# Altium project CEM3340_vco.PrjPcb (part 1 of 2)
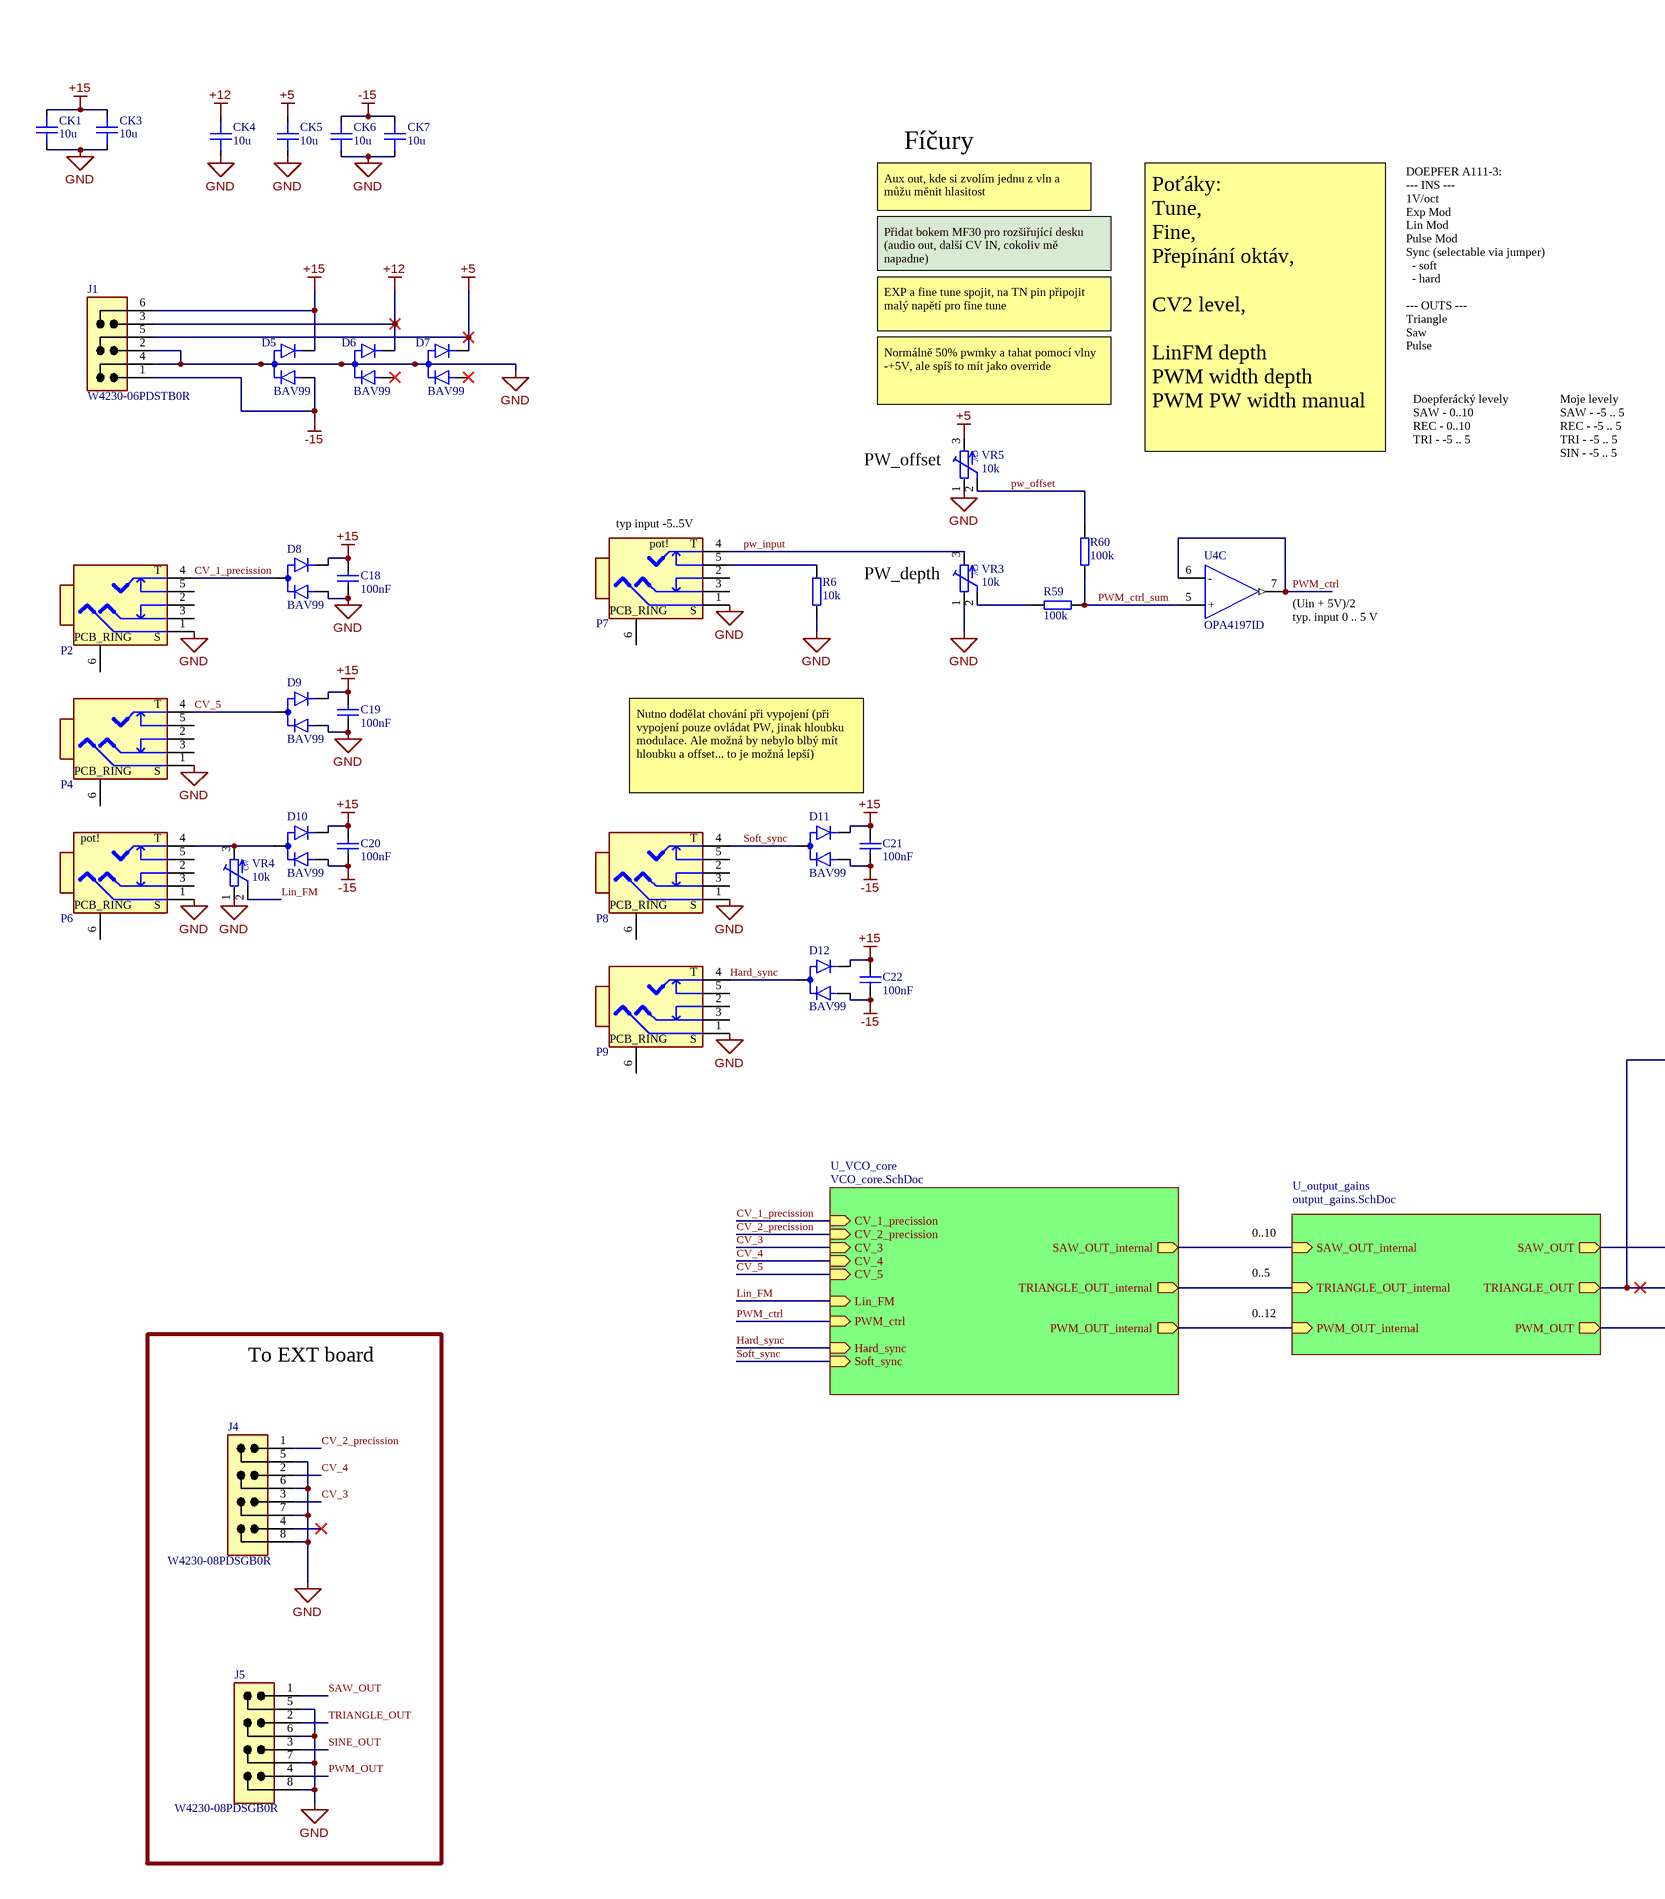
[diagram p0: main.SchDoc, left]
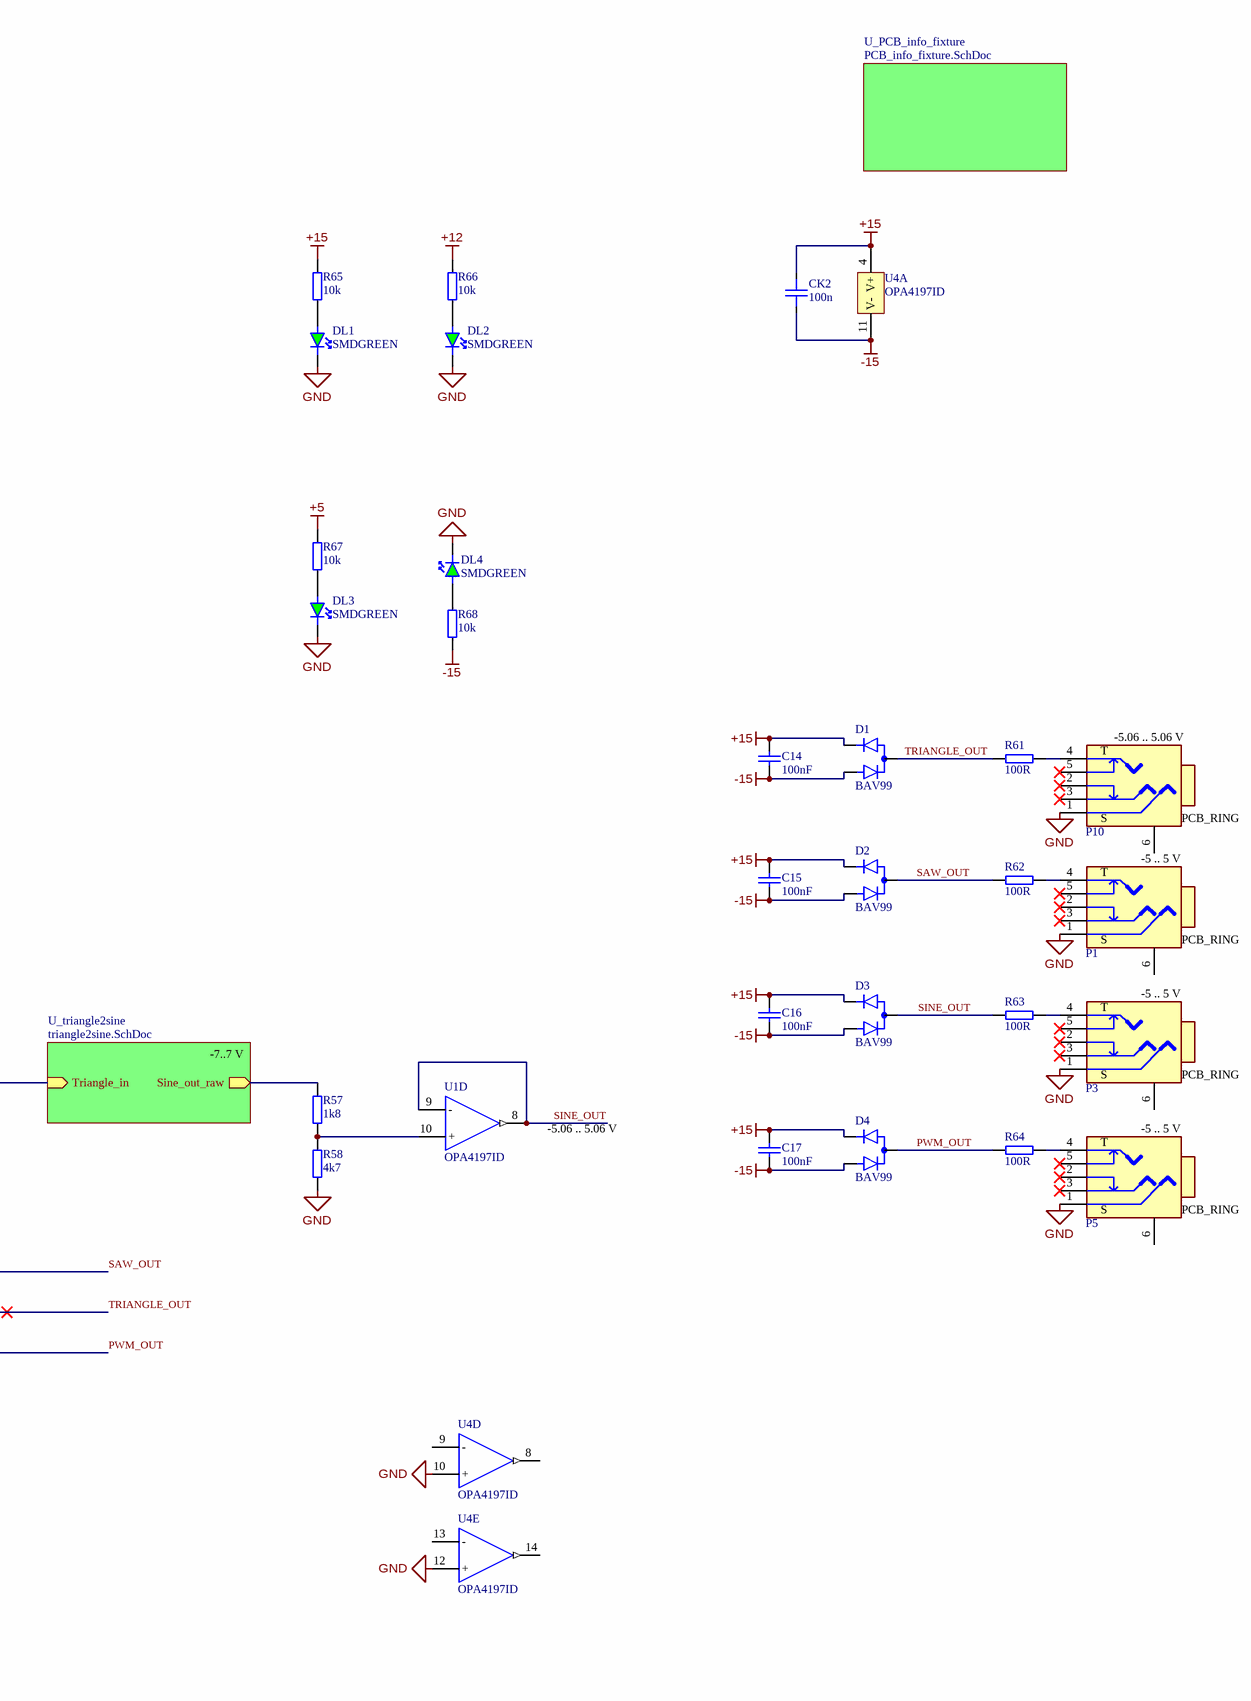
[diagram p1: main.SchDoc, right]
5 sheets, 145 parts. Net scope: hierarchical (ports join the sheet entries above them; power ports are global).
Board file: CEM3340_vco.PcbDoc
Sheets:
  main.SchDoc
    U_VCO_core = VCO_core.SchDoc
    U_output_gains = output_gains.SchDoc
    U_triangle2sine = triangle2sine.SchDoc
    U_PCB_info_fixture = PCB_info_fixture.SchDoc

## Sheet main.SchDoc
size A2; Organization: Medical Technologies CZ a.s.; Version1: N/A; Version2: N/A; Version3: N/A; Change1description: N/A; Change2description: N/A; Change3description: N/A; Change1DrawnBy: N/A; Change2DrawnBy: N/A; Change3DrawnBy: N/A; Change1CheckedBy: N/A; Change2CheckedBy: N/A; Change3CheckedBy: N/A; PreviusVersion_Chng1: N/A; PreviusVersion_Chng2: N/A; PreviusVersion_Chng3: N/A; Variant1description: Standard assembly; Variant2description: N/A; Variant3description: N/A; Variant4description: N/A; PrimaryCard1: XXXxxxXXX; PrimaryCard2: N/A; PrimaryCard3: N/A; PrimaryCard4: N/A; SPICEModelCacheQPKUSXFH: <root> / <DocumentId>QPKUSXFH</DocumentId> / <CacheFrame Number="0"> / <Model Name="vccs_lim_4_opa197" Kind="CKT"> / <Text>* / .subckt VCCS_LIM_4_OPA197 VC+ VC- IOUT+ IOUT- / .param Gain = 1 / .param Ipos = 1.044 / .param Ineg = -1.044 / G1 IOUT+ IOUT- VALUE={LIMIT(Gain*V(VC+,VC-),Ineg,Ipos)} / .ends VCCS_LIM_4_OPA197</Text> / </Model> / <Model Name="vccs_lim_clawp_opa197" Kind="CKT"> / <Text>* / .subckt VCCS_LIM_CLAWp_OPA197 VC+ VC- IOUT+ IOUT- / G1 IOUT+ IOUT- TABLE {(V(VC+,VC-))} = / +(0, 8.15e-6) / +(31.9, 1.41e-3) / +(44.7, 2.13e-3) / +(57.1, 3.04e-3) / +(63.8, 3.76e-3) / +(66.5, 4.23e-3) / +(67.7, 4.54e-3) / +(68.9, 1.77e-2) / .ends VCCS_LIM_CLAWp_OPA197</Text> / </Model> / <Model Name="vos_drift_opa197" Kind="CKT"> / <Text>* / .SUBCKT VOS_DRIFT_OPA197  VOS+ VOS- / .PARAM DC = 1.712E-05 / .PARAM POL = 1 / .PARAM DRIFT = 2.50E-07 / E1 VOS+ VOS- VALUE={DC+POL*DRIFT*(TEMP-27)} / .ENDS</Text> / </Model> / <Model Name="vccs_lim_clawn_opa197" Kind="CKT"> / <Text>* / .subckt VCCS_LIM_CLAWn_OPA197 VC+ VC- IOUT+ IOUT- / G1 IOUT+ IOUT- TABLE {(V(VC+,VC-))} = / +(0, 8.23e-6) / +(15.9, 6.9e-4) / +(63.8, 3.18e-3) / +(67.7, 3.54e-3) / +(68.9, 1.8e-2) / .ends VCCS_LIM_CLAWn_OPA197</Text> / </Model> / <Model Name="vccs_ext_lim_opa197" Kind="CKT"> / <Text>* / .subckt VCCS_EXT_LIM_OPA197 VIN+ VIN- IOUT- IOUT+ VP+ VP- / .param Gain = 1 / G1 IOUT+ IOUT- VALUE={LIMIT(Gain*V(VIN+,VIN-),V(VP-,VIN-), V(VP+,VIN-))} / .ends VCCS_EXT_LIM_OPA197</Text> / </Model> / <Model Name="vccs_lim_iq_opa197" Kind="CKT"> / <Text>* / .subckt VCCS_LIM_IQ_OPA197 VC+ VC- IOUT+ IOUT- / .param Gain = 1e-3 / G1 IOUT+ IOUT- VALUE={IF( (V(VC+,VC-)&lt;=0),0,Gain*V(VC+,VC-) )} / .ends VCCS_LIM_IQ_OPA197</Text> / </Model> / <Model Name="clamp_amp_lo_opa197" Kind="CKT"> / <Text>* / .subckt CLAMP_AMP_LO_OPA197 VC+ VC- VIN COM VO+ VO- / .param G=1 / GVo+ COM Vo+ Value = {IF(V(VIN,COM)&gt;V(VC+,COM),((V(VIN,COM)-V(VC+,COM))*G),0)} / GVo- COM Vo- Value = {IF(V(VIN,COM)&lt;V(VC-,COM),((V(VC-,COM)-V(VIN,COM))*G),0)} / .ends CLAMP_AMP_LO_OPA197</Text> / </Model> / <Model Name="ol_sense_opa197" Kind="CKT"> / <Text>* / .subckt OL_SENSE_OPA197 1   2  3  4 / GSW+ 1 2 Value = {IF((V(3,1)&gt;10e-3 | V(4,1)&gt;10e-3),1,0)} / .ends OL_SENSE_OPA197</Text> / </Model> / <Model Name="vccs_lim_3_opa197" Kind="CKT"> / <Text>* / .subckt VCCS_LIM_3_OPA197 VC+ VC- IOUT+ IOUT- / .param Gain = 1 / .param Ipos = 0.522 / .param Ineg = -0.522 / G1 IOUT+ IOUT- VALUE={LIMIT(Gain*V(VC+,VC-),Ineg,Ipos)} / .ends VCCS_LIM_3_OPA197</Text> / </Model> / <Model Name="vccs_lim_2_opa197" Kind="CKT"> / <Text>* / .subckt VCCS_LIM_2_OPA197 VC+ VC- IOUT+ IOUT- / .param Gain = 74.5e-3 / .param Ipos = 2.4 / .param Ineg = -2.4 / G1 IOUT+ IOUT- VALUE={LIMIT(Gain*V(VC+,VC-),Ineg,Ipos)} / .ends VCCS_LIM_2_OPA197</Text> / </Model> / <Model Name="clamp_amp_hi_opa197" Kind="CKT"> / <Text>* / .subckt CLAMP_AMP_HI_OPA197 VC+ VC- VIN COM VO+ VO- / .param G=10 / GVo+ COM Vo+ Value = {IF(V(VIN,COM)&gt;V(VC+,COM),((V(VIN,COM)-V(VC+,COM))*G),0)} / GVo- COM Vo- Value = {IF(V(VIN,COM)&lt;V(VC-,COM),((V(VC-,COM)-V(VIN,COM))*G),0)} / .ends CLAMP_AMP_HI_OPA197</Text> / </Model> / <Model Name="vccs_lim_gr_opa197" Kind="CKT"> / <Text>* / .subckt VCCS_LIM_GR_OPA197 VC+ VC- IOUT+ IOUT- / .param Gain = 1 / .param Ipos = 4.8 / .param Ineg = -4.8 / G1 IOUT+ IOUT- VALUE={LIMIT(Gain*V(VC+,VC-),Ineg,Ipos)} / .ends VCCS_LIM_GR_OPA197</Text> / </Model> / <Model Name="vnse_opa197" Kind="CKT"> / <Text>* / .subckt VNSE_OPA197 1 2 / .param FLW=0.1 / .param GLF=0.1352 / .param RNV=35.8 / .model DVN D KF={PWR(FLW,0.5)/1E11} IS=1.0E-16 / I1 0 7 10E-3 / I2 0 8 10E-3 / D1 7 0 DVN / D2 8 0 DVN / E1 3 6 7 8 {GLF} / R1 3 0 1E9 / R2 3 0 1E9 / R3 3 6 1E9 / E2 6 4 5 0 10 / R4 5 0 {RNV} / R5 5 0 {RNV} / R6 3 4 1E9 / R7 4 0 1E9 / E3 1 2 3 4 1 / .ends VNSE_OPA197</Text> / </Model> / <Model Name="vccs_lim_zo_opa197" Kind="CKT"> / <Text>* / .subckt VCCS_LIM_ZO_OPA197 VC+ VC- IOUT+ IOUT- / .param Gain = 66667 / .param Ipos = 2.11e4 / .param Ineg = -2.11e4 / G1 IOUT+ IOUT- VALUE={LIMIT(Gain*V(VC+,VC-),Ineg,Ipos)} / .ends VCCS_LIM_ZO_OPA197</Text> / </Model> / <Model Name="femt_opa197" Kind="CKT"> / <Text>* / .subckt FEMT_OPA197 1 2 / .param NVRF=1.5 / .param RNVF={1.184*PWR(NVRF,2)} / E1 3 0 5 0 10 / R1 5 0 {RNVF} / R2 5 0 {RNVF} / G1 1 2 3 0 1e-6 / .ends FEMT_OPA197</Text> / </Model> / <Model Name="vccs_lim_1_opa197" Kind="CKT"> / <Text>* / .subckt VCCS_LIM_1_OPA197 VC+ VC- IOUT+ IOUT- / .param Gain = 1e-4 / .param Ipos = .5 / .param Ineg = -.5 / G1 IOUT+ IOUT- VALUE={LIMIT(Gain*V(VC+,VC-),Ineg,Ipos)} / .ends VCCS_LIM_1_OPA197</Text> / </Model> / <Model Name="opa197" Kind="CKT"> / <Text>*$ / * OPA197 / ***************************************************************************** / * (C) Copyright 2019 Texas Instruments Incorporated. All rights reserved. / ***************************************************************************** / ** This model is designed as an aid for customers of Texas Instruments. / ** TI and its licensors and suppliers make no warranties, either expressed / ** or implied, with respect to this model, including the warranties of / ** merchantability or fitness for a particular purpose.  The model is / ** provided solely on an "as is" basis.  The entire risk as to its quality / ** and performance is with the customer / ***************************************************************************** / * / * This model is subject to change without notice. Texas Instruments / * Incorporated is not responsible for updating this model. / * / ***************************************************************************** / * / ** Released by: Online Design Tools, Texas Instruments Inc. / * Part: OPA197 / * Date: 30JAN2019 / * Model Type: Generic (suitable for all analysis types) / * EVM Order Number: N/A / * EVM Users Guide:  N/A / * Datasheet: SBOS737C â€“JANUARY 2016â€“REVISED MARCH 2018 / * Created with Green-Williams-Lis Op Amp Macro-model Architecture / * / * Model Version: Final 1.1 / * / ***************************************************************************** / * / * Final 1.1 / * Updated with unique subckt name, Vos drift, Current Noise and edits in claw block / * / * Final 1.0 / * Release to Web. / * / ***************************************************************************** / * Model Usage Notes: / * 1. The following parameters are modeled: / * 		OPEN-LOOP GAIN AND PHASE VS. FREQUENCY  WITH RL, CL EFFECTS (Aol) / * 		UNITY GAIN BANDWIDTH (GBW) / * 		INPUT COMMON-MODE REJECTION RATIO VS. FREQUENCY (CMRR) / * 		POWER SUPPLY REJECTION RATIO VS. FREQUENCY (PSRR) / * 		DIFFERENTIAL INPUT IMPEDANCE (Zid) / * 		COMMON-MODE INPUT IMPEDANCE (Zic) / * 		OPEN-LOOP OUTPUT IMPEDANCE VS. FREQUENCY (Zo) / * 		OUTPUT CURRENT THROUGH THE SUPPLY (Iout) / * 		INPUT VOLTAGE NOISE DENSITY VS. FREQUENCY (en) / * 		INPUT CURRENT NOISE DENSITY VS. FREQUENCY (in) / * 		OUTPUT VOLTAGE SWING vs. OUTPUT CURRENT (Vo) / * 		SHORT-CIRCUIT OUTPUT CURRENT (Isc) / * 		QUIESCENT CURRENT (Iq) / * 		SETTLING TIME VS. CAPACITIVE LOAD (ts) / * 		SLEW RATE (SR) / * 		SMALL SIGNAL OVERSHOOT VS. CAPACITIVE LOAD / * 		LARGE SIGNAL RESPONSE / * 		OVERLOAD RECOVERY TIME (tor) / * 		INPUT BIAS CURRENT (Ib) / * 		INPUT OFFSET CURRENT (Ios) / * 		INPUT OFFSET VOLTAGE (Vos) / * 		INPUT OFFSET VOLTAGE VS. TEMPERATURE (VOS DRIFT) / * 		INPUT COMMON-MODE VOLTAGE RANGE (Vcm) / * 		INPUT OFFSET VOLTAGE VS. INPUT COMMON-MODE VOLTAGE (Vos vs. Vcm) / * 		INPUT/OUTPUT ESD CELLS (ESDin, ESDout) / ****************************************************** / .subckt OPA197 IN+ IN- VCC VEE OUT / ****************************************************** / * MODEL DEFINITIONS: / .model ESD_SW VSWITCH(Ron=50 Roff=1e12 Von=700e-3 Voff=100e-3) / .model OL_SW VSWITCH(Ron=1e-3 Roff=1e9 Von=900e-3 Voff=800e-3) / .model OR_SW VSWITCH(Ron=10e-3 Roff=1e9 Von=10e-3 Voff=0) / .model R_NOISELESS RES(T_ABS=-273.15) / ****************************************************** / XV_OS N035 N041 VOS_DRIFT_OPA197 / R1 N038 N036 R_NOISELESS 1e-3 / R2 N047 ESDn R_NOISELESS 1e-3 / R3 N059 0 R_NOISELESS 1e12 / C1 N059 0 1 / R4 VCC_B N058 R_NOISELESS 1e-3 / C2 N058 0 1e-15 / C3 N060 0 1e-15 / R5 N060 VEE_B R_NOISELESS 1e-3 / G1 N038 N039 N007 N006 1e-3 / R6 MID N045 R_NOISELESS 1e12 / VCM_MIN N046 VEE_B -0.1 / R7 N046 MID R_NOISELESS 1e12 / VCM_MAX N045 VCC_B 0.1 / XVCM_CLAMP N039 MID N042 MID N045 N046 VCCS_EXT_LIM_OPA197 / R8 N042 MID R_NOISELESS 1 / C4 N043 MID 1e-15 / R9 N042 N043 R_NOISELESS 1e-3 / V4 N056 OUT 0 / R10 MID N048 R_NOISELESS 1e12 / R11 MID N049 R_NOISELESS 1e12 / XIQp VIMON MID VCC MID VCCS_LIM_IQ_OPA197 / XIQn MID VIMON MID VEE VCCS_LIM_IQ_OPA197 / R12 VCC_B N012 R_NOISELESS 1e3 / R13 N025 VEE_B R_NOISELESS 1e3 / XCLAWp VIMON MID N012 VCC_B VCCS_LIM_CLAWp_OPA197 / XCLAWn MID VIMON VEE_B N025 VCCS_LIM_CLAWn_OPA197 / R14 VEE_CLP MID R_NOISELESS 1e3 / R15 MID VCC_CLP R_NOISELESS 1e3 / R16 N013 N012 R_NOISELESS 1e-3 / R17 N026 N025 R_NOISELESS 1e-3 / C5 MID N013 1e-15 / C6 N026 MID 1e-15 / R18 VOUT_S N049 R_NOISELESS 100 / C7 VOUT_S MID 1e-12 / G2 MID VCC_CLP N013 MID 1e-3 / G3 MID VEE_CLP N026 MID 1e-3 / XCL_AMP N010 N037 VIMON MID N016 N023 CLAMP_AMP_LO_OPA197 / V_ISCp N010 MID 65 / V_ISCn N037 MID -65 / XOL_SENSE_OPA197 MID N063 N062 N065 OL_SENSE_OPA197 / R19 N037 MID R_NOISELESS 1e12 / R20 N023 MID R_NOISELESS 1 / C8 N024 MID 1e-15 / R21 MID N016 R_NOISELESS 1 / R22 MID N010 R_NOISELESS 1e12 / C9 MID N017 1e-15 / XCLAW_AMP VCC_CLP VEE_CLP VOUT_S MID N014 N021 CLAMP_AMP_LO_OPA197 / R23 VEE_CLP MID R_NOISELESS 1e12 / R24 N021 MID R_NOISELESS 1 / C10 N022 MID 1e-15 / R25 MID N014 R_NOISELESS 1 / R26 MID VCC_CLP R_NOISELESS 1e12 / C11 MID N015 1e-15 / XCL_SRC N017 N024 CL_CLAMP MID VCCS_LIM_4_OPA197 / XCLAW_SRC N015 N022 CLAW_CLAMP MID VCCS_LIM_3_OPA197 / R27 N014 N015 R_NOISELESS 1e-3 / R28 N022 N021 R_NOISELESS 1e-3 / R29 N016 N017 R_NOISELESS 1e-3 / R30 N024 N023 R_NOISELESS 1e-3 / R31 N063 MID R_NOISELESS 1 / R32 N063 SW_OL R_NOISELESS 100 / C12 SW_OL MID 1e-12 / R33 VIMON N048 R_NOISELESS 100 / C13 VIMON MID 1e-12 / C_DIFF ESDp ESDn 1.6e-12 / C_CMn ESDn MID 6.4e-12 / C_CMp MID ESDp 6.4e-12 / I_Q VCC VEE 1e-3 / I_B N041 MID 5e-12 / I_OS ESDn MID 3e-12 / R34 IN+ ESDp R_NOISELESS 100 / R35 IN- ESDn R_NOISELESS 100 / R36 N033 MID R_NOISELESS 1 / R37 N040 MID R_NOISELESS 1e12 / R38 MID N019 R_NOISELESS 1 / R39 MID N011 R_NOISELESS 1e12 / XGR_AMP N011 N040 N018 MID N019 N033 CLAMP_AMP_HI_OPA197 / XGR_SRC N020 N034 CLAMP MID VCCS_LIM_GR_OPA197 / C17 MID N020 1e-15 / C18 N034 MID 1e-15 / V_GRn N040 MID -251 / V_GRp N011 MID 251 / R40 N019 N020 R_NOISELESS 1e-3 / R41 N034 N033 R_NOISELESS 1e-3 / R42 VSENSE N018 R_NOISELESS 1e-3 / C19 MID N018 1e-15 / R43 MID VSENSE R_NOISELESS 1e3 / G5 N035 N036 N009 MID 1e-3 / G8 MID CLAW_CLAMP N050 MID 1e-3 / R45 MID CLAW_CLAMP R_NOISELESS 1e3 / G9 MID CL_CLAMP CLAW_CLAMP MID 1e-3 / R46 MID CL_CLAMP R_NOISELESS 1e3 / R47 N057 VCLP R_NOISELESS 100 / C24 MID VCLP 1e-12 / E4 N057 MID CL_CLAMP MID 1 / E5 N049 MID OUT MID 1 / H1 N048 MID V4 1e3 / S1 N052 N051 SW_OL MID OL_SW / R52 MID ESDp R_NOISELESS 1e12 / R53 ESDn MID R_NOISELESS 1e12 / R58 N036 N035 R_NOISELESS 1e3 / R59 N058 N059 R_NOISELESS 1e6 / R60 N059 N060 R_NOISELESS 1e6 / R67 N039 N038 R_NOISELESS 1e3 / G15 MID VSENSE CLAMP MID 1e-3 / V_ORp N032 VCLP 4 / V_ORn N027 VCLP -4 / V11 N029 N028 0 / V12 N030 N031 0 / H2 N061 MID V11 -1 / H3 N064 MID V12 1 / S2 VCC ESDn ESDn VCC ESD_SW / S3 VCC ESDp ESDp VCC ESD_SW / S4 ESDn VEE VEE ESDn ESD_SW / S5 ESDp VEE VEE ESDp ESD_SW / S6 VCC OUT OUT VCC ESD_SW / S7 OUT VEE VEE OUT ESD_SW / E1 MID 0 N059 0 1 / G16 0 VCC_B VCC 0 1 / G17 0 VEE_B VEE 0 1 / R88 VCC_B 0 R_NOISELESS 1 / R89 VEE_B 0 R_NOISELESS 1 / S8 N030 CLAMP CLAMP N030 OR_SW / S9 CLAMP N029 N029 CLAMP OR_SW / Xe_n ESDp N041 VNSE_OPA197 / Xi_nn ESDn MID FEMT_OPA197 / Xi_np N041 MID FEMT_OPA197 / XVCCS_LIMIT_1 N043 N047 MID N044 VCCS_LIM_1_OPA197 / XVCCS_LIMIT_2 N044 MID MID CLAMP VCCS_LIM_2_OPA197 / R44 N044 MID R_NOISELESS 1e6 / R68 CLAMP MID R_NOISELESS 1e6 / G7 MID N050 VSENSE MID 1e-6 / R69 N050 MID R_NOISELESS 1e6 / R72 N062 N061 R_NOISELESS 100 / R75 N064 N065 R_NOISELESS 100 / C27 N062 MID 1e-9 / C28 N065 MID 1e-9 / XVCCS_LIM_ZO_OPA197 N054 MID MID N055 VCCS_LIM_ZO_OPA197 / C15 N007 N008 4.97e-10 / R54 N007 MID R_NOISELESS 320 / R55 N007 N008 R_NOISELESS 1e8 / G13 MID N008 VCC_B MID 68.4e-3 / Rsrc4 N008 MID R_NOISELESS 1 / C16 N006 N005 4.97e-10 / R56 N006 MID R_NOISELESS 320 / R57 N006 N005 R_NOISELESS 1e8 / G14 MID N005 VEE_B MID 68.4e-3 / Rsrc2 N005 MID R_NOISELESS 1 / Rx N056 N055 R_NOISELESS 3.25e5 / Rdummy N056 MID R_NOISELESS 3.25e4 / G4 MID N051 CL_CLAMP N056 90.91 / Rdc1 N051 MID R_NOISELESS 1 / R51 N051 N052 R_NOISELESS 1e4 / R64 N052 MID R_NOISELESS 1184.21 / G6 MID N053 N052 MID 9.44 / C23 N052 N051 1.77e-5 / R65 N053 N054 R_NOISELESS 1e4 / R66 N054 MID R_NOISELESS 0.15 / C26 N054 N053 1.06e-11 / R70 N055 MID R_NOISELESS 1 / R71 N053 MID R_NOISELESS 1 / C21 CLAMP MID 1.13e-7 / C29 N050 MID 7e-15 / C20 N002 N001 7.234e-10 / R50 N002 MID R_NOISELESS 2.2 / R61 N002 N001 R_NOISELESS 1e4 / G_adjust1 MID N001 ESDp MID 454e-6 / Rsrc3 N001 MID R_NOISELESS 1 / G18 MID N003 MID N002 1 / Rsrc5 N003 MID R_NOISELESS 1 / C22 N004 N003 7.234e-10 / R62 N004 N003 R_NOISELESS 1e4 / R63 N004 MID R_NOISELESS 2.2 / G19 MID N009 MID N004 4545.45 / Rsrc6 N009 MID R_NOISELESS 1 / G10 MID N028 N027 MID 1 / G11 MID N031 N032 MID 1 / R48 N028 MID R_NOISELESS 1 / R49 N031 MID R_NOISELESS 1 / .ends OPA197</Text> / <Dependency>0\vccs_lim_4_opa197</Dependency> / <Dependency>0\vccs_lim_clawp_opa197</Dependency> / <Dependency>0\vos_drift_opa197</Dependency> / <Dependency>0\vccs_lim_clawn_opa197</Dependency> / <Dependency>0\vccs_ext_lim_opa197</Dependency> / <Dependency>0\vccs_lim_iq_opa197</Dependency> / <Dependency>0\clamp_amp_lo_opa197</Dependency> / <Dependency>0\ol_sense_opa197</Dependency> / <Dependency>0\vccs_lim_3_opa197</Dependency> / <Dependency>0\vccs_lim_2_opa197</Dependency> / <Dependency>0\clamp_amp_hi_opa197</Dependency> / <Dependency>0\vccs_lim_gr_opa197</Dependency> / <Dependency>0\vnse_opa197</Dependency> / <Dependency>0\vccs_lim_zo_opa197</Dependency> / <Dependency>0\femt_opa197</Dependency> / <Dependency>0\vccs_lim_1_opa197</Dependency> / </Model> / <Model Name="opa197full" Kind="CKT"> / <Text>.SUBCKT OPA197FULL    O1 I1M I1P VCC I2P I2M O2 O3 I3M I3P GND I4P I4M O4 / X1 I1P I1M VCC GND O1 OPA197 / X2 I2P I2M VCC GND O2 OPA197 / X3 I3P I3M VCC GND O3 OPA197 / X4 I4P I4M VCC GND O4 OPA197 / .ENDS OPA197FULL</Text> / <Dependency>0\opa197</Dependency> / </Model> / </CacheFrame> / </root>; DocumentName: Docname

### Parts
C14  100nF  [WCAP-CSGP_0603_L1.6W0.8H0.8_Reflow]
C15  100nF  [WCAP-CSGP_0603_L1.6W0.8H0.8_Reflow]
C16  100nF  [WCAP-CSGP_0603_L1.6W0.8H0.8_Reflow]
C17  100nF  [WCAP-CSGP_0603_L1.6W0.8H0.8_Reflow]
C18  100nF  [WCAP-CSGP_0603_L1.6W0.8H0.8_Reflow]
C19  100nF  [WCAP-CSGP_0603_L1.6W0.8H0.8_Reflow]
C20  100nF  [WCAP-CSGP_0603_L1.6W0.8H0.8_Reflow]
C21  100nF  [WCAP-CSGP_0603_L1.6W0.8H0.8_Reflow]
C22  100nF  [WCAP-CSGP_0603_L1.6W0.8H0.8_Reflow]
CK1  10u  [CAPC3225X27N(SMC1210)]
CK2  100n  [CAPC1608X09N(SMC0603)]
CK3  10u  [CAPC3225X27N(SMC1210)]
CK4  10u  [CAPC3225X27N(SMC1210)]
CK5  10u  [CAPC3225X27N(SMC1210)]
CK6  10u  [CAPC3225X27N(SMC1210)]
CK7  10u  [CAPC3225X27N(SMC1210)]
D1  BAV99  [SOT95P230X110-3N(SOT23)]
D2  BAV99  [SOT95P230X110-3N(SOT23)]
D3  BAV99  [SOT95P230X110-3N(SOT23)]
D4  BAV99  [SOT95P230X110-3N(SOT23)]
D5  BAV99  [SOT95P230X110-3N(SOT23)]
D6  BAV99  [SOT95P230X110-3N(SOT23)]
D7  BAV99  [SOT95P230X110-3N(SOT23)]
D8  BAV99  [SOT95P230X110-3N(SOT23)]
D9  BAV99  [SOT95P230X110-3N(SOT23)]
D10  BAV99  [SOT95P230X110-3N(SOT23)]
D11  BAV99  [SOT95P230X110-3N(SOT23)]
D12  BAV99  [SOT95P230X110-3N(SOT23)]
DL1  SMDGREEN  [DIOC2012X12N(SMLED0805)G]
DL2  SMDGREEN  [DIOC2012X12N(SMLED0805)G]
DL3  SMDGREEN  [DIOC2012X12N(SMLED0805)G]
DL4  SMDGREEN  [DIOC2012X12N(SMLED0805)G]
J1  W4230-06PDSTB0R  [W4230-06PDS]
J4  W4230-08PDSGB0R  [W4230-08PDS]
J5  W4230-08PDSGB0R  [W4230-08PDS]
P1  NYS232  [NYS232]  (value not drawn)
P2  NYS232  [NYS232]  (value not drawn)
P3  NYS232  [NYS232]  (value not drawn)
P4  NYS232  [NYS232]  (value not drawn)
P5  NYS232  [NYS232]  (value not drawn)
P6  NYS232  [NYS232]  (value not drawn)
P7  NYS232  [NYS232]  (value not drawn)
P8  NYS232  [NYS232]  (value not drawn)
P9  NYS232  [NYS232]  (value not drawn)
P10  NYS232  [NYS232]  (value not drawn)
R6  10k  [RESC1608X06N(SMR0603)]
R57  1k8  [RESC1608X06N(SMR0603)]
R58  4k7  [RESC1608X06N(SMR0603)]
R59  100k  [RESC1608X06N(SMR0603)]
R60  100k  [RESC1608X06N(SMR0603)]
R61  100R  [RESC1608X06N(SMR0603)]
R62  100R  [RESC1608X06N(SMR0603)]
R63  100R  [RESC1608X06N(SMR0603)]
R64  100R  [RESC1608X06N(SMR0603)]
R65  10k  [RESC1608X06N(SMR0603)]
R66  10k  [RESC1608X06N(SMR0603)]
R67  10k  [RESC1608X06N(SMR0603)]
R68  10k  [RESC1608X06N(SMR0603)]
U1  OPA4197ID  [SOIC127P600X175-14N(SO-14)]  (part D of 5)
U4  OPA4197ID  [SOIC127P600X175-14N(SO-14)]  (parts A,C,D,E of 5)
VR3  10k  [64W]
VR4  10k  [64W]
VR5  10k  [64W]

### Blocks framed on the sheet
To EXT board: J4 J5

### Sub-sheets
U_output_gains = output_gains.SchDoc: PWM_OUT_internal (in), SAW_OUT_internal (in), SAW_OUT (out), TRIANGLE_OUT_internal (in), PWM_OUT (out), TRIANGLE_OUT (out)
U_PCB_info_fixture = PCB_info_fixture.SchDoc: no entries
U_triangle2sine = triangle2sine.SchDoc: Triangle_in (in), Sine_out_raw (out)
U_VCO_core = VCO_core.SchDoc: Hard_sync (in), CV_2_precission (in), CV_1_precission (in), PWM_ctrl (in), TRIANGLE_OUT_internal (out), CV_5 (in), CV_4 (in), CV_3 (in), SAW_OUT_internal (out), Lin_FM (in), PWM_OUT_internal (out), Soft_sync (in)

### Nets
+5: CK5.1 D7.2(C2) J1.5 R67.2 VR5.3
+12: CK4.1 D6.2(C2) J1.3 R66.2
+15: C14.2 C15.2 C16.2 C17.2 C18.2 C19.2 C20.2 C21.2 C22.2 CK1.1 CK2.1 CK3.1 D1.2(C2) D2.2(C2) D3.2(C2) D4.2(C2) D5.2(C2) D8.2(C2) D9.2(C2) D10.2(C2) D11.2(C2) D12.2(C2) J1.6 R65.2 U4.4(V+)
-15: C14.1 C15.1 C16.1 C17.1 C20.1 C21.1 C22.1 CK2.2 CK6.1 CK7.1 D1.1(A1) D2.1(A1) D3.1(A1) D4.1(A1) D5.1(A1) D10.1(A1) D11.1(A1) D12.1(A1) J1.1 R68.1 U4.11(V-)
GND: C18.1 C19.1 CK1.2 CK3.2 CK4.2 CK5.2 CK6.2 CK7.2 D5.3(C1A2) D6.3(C1A2) D7.3(C1A2) D8.1(A1) D9.1(A1) DL1.1(C) DL2.1(C) DL3.1(C) DL4.1(C) J1.2 J1.4 J4.5 J4.6 J4.7 J4.8 J5.5 J5.6 J5.7 J5.8 P1.1(S) P2.1(S) P3.1(S) P4.1(S) P5.1(S) P6.1(S) P7.1(S) P8.1(S) P9.1(S) P10.1(S) R6.1 R58.1 U4.10(+) U4.12(+) VR3.1 VR4.1 VR5.1
CV_1_precission: D8.3(C1A2) P2.4(TN) ; sheet U_VCO_core/CV_1_precission
CV_2_precission: J4.1 ; sheet U_VCO_core/CV_2_precission
CV_3: J4.3 ; sheet U_VCO_core/CV_3
CV_4: J4.2 ; sheet U_VCO_core/CV_4
CV_5: D9.3(C1A2) P4.4(TN) ; sheet U_VCO_core/CV_5
Hard_sync: D12.3(C1A2) P9.4(TN) ; sheet U_VCO_core/Hard_sync
Lin_FM: VR4.2 ; sheet U_VCO_core/Lin_FM
pw_input: P7.4(TN) VR3.3
pw_offset: R60.2 VR5.2
PWM_ctrl: U4.6(-) U4.7(OUT2) ; sheet U_VCO_core/PWM_ctrl
PWM_ctrl_sum: R59.1 R60.1 U4.5(+)
PWM_OUT: D4.3(C1A2) J5.4 R64.1 ; sheet U_output_gains/PWM_OUT
SAW_OUT: D2.3(C1A2) J5.1 R62.1 ; sheet U_output_gains/SAW_OUT
SINE_OUT: D3.3(C1A2) J5.3 R63.1 U1.8(OUT3) U1.9(-)
Soft_sync: D11.3(C1A2) P8.4(TN) ; sheet U_VCO_core/Soft_sync
TRIANGLE_OUT: D1.3(C1A2) J5.2 R61.1 ; sheet U_output_gains/TRIANGLE_OUT, sheet U_triangle2sine/Triangle_in
NetC10_2: R57.2 ; sheet U_triangle2sine/Sine_out_raw
NetD10_3: D10.3(C1A2) P6.4(TN) VR4.3
NetDL1_2: DL1.2(A) R65.1
NetDL2_2: DL2.2(A) R66.1
NetDL3_2: DL3.2(A) R67.1
NetDL4_2: DL4.2(A) R68.2
NetP1_4: P1.4(TN) R62.2
NetP3_4: P3.4(TN) R63.2
NetP5_4: P5.4(TN) R64.2
NetP7_5: P7.5(T) R6.2
NetP10_4: P10.4(TN) R61.2
NetR15_2: sheet U_VCO_core/PWM_OUT_internal, sheet U_output_gains/PWM_OUT_internal
NetR42_2: sheet U_VCO_core/SAW_OUT_internal, sheet U_output_gains/SAW_OUT_internal
NetR57_1: R57.1 R58.2 U1.10(+)
NetR59_2: R59.2 VR3.2
NetU3_10: sheet U_VCO_core/TRIANGLE_OUT_internal, sheet U_output_gains/TRIANGLE_OUT_internal

Not connected (* = marked no-connect by the designer): D6 1(A1)*; D7 1(A1)*; J4 4*; P1 2(RN)* 3(R)* 5(T)* 6(PCB_RING); P2 2(RN) 3(R) 5(T) 6(PCB_RING); P3 2(RN)* 3(R)* 5(T)* 6(PCB_RING); P4 2(RN) 3(R) 5(T) 6(PCB_RING); P5 2(RN)* 3(R)* 5(T)* 6(PCB_RING); P6 2(RN) 3(R) 5(T) 6(PCB_RING); P7 2(RN) 3(R) 6(PCB_RING); P8 2(RN) 3(R) 5(T) 6(PCB_RING); P9 2(RN) 3(R) 5(T) 6(PCB_RING); P10 2(RN)* 3(R)* 5(T)* 6(PCB_RING); U4 8(OUT3) 9(-) 13(-) 14(OUT4)

### Notes on the sheet
- Fíčury
- Aux out, kde si zvolím jednu z vln a můžu měnit hlasitost
- Přidat bokem MF30 pro rozšiřující desku (audio out, další CV IN, cokoliv mě napadne)
- EXP a fine tune spojit, na TN pin připojit malý napětí pro fine tune
- DOEPFER A111-3:
  --- INS ---
  1V/oct
  Exp Mod
  Lin Mod
  Pulse Mod
  Sync (selectable via jumper)
  - soft
  - hard
  --- OUTS ---
  Triangle
  Saw
  Pulse
- (near VR5) Normálně 50% pwmky a tahat pomocí vlny -+5V, ale spíš to mít jako override
- Poťáky:
  Tune,
  Fine,
  Přepínání oktáv,
  CV2 level,
  LinFM depth
  PWM width depth
  PWM PW width manual
- Doepferácký levely
  SAW - 0..10
  REC - 0..10
  TRI - -5 .. 5
- Moje levely
  SAW - -5 .. 5
  REC - -5 .. 5
  TRI - -5 .. 5
  SIN - -5 .. 5
- (near VR5) PW_offset
- (near P7) typ input -5..5V
- (near P7) pot!
- (near VR3) PW_depth
- (near U4) typ. input 0 .. 5 V
- (near U4) (Uin + 5V)/2
- (near P10) -5.06 .. 5.06 V
- Nutno dodělat chování při vypojení (při vypojení pouze ovládat PW, jinak hloubku modulace. Ale možná by nebylo blbý mít hloubku a offset... to je možná lepší)
- (near P6) pot!
- (near P1) -5 .. 5 V
- (near P3) -5 .. 5 V
- -7..7 V
- (near U1) -5.06 .. 5.06 V
- (near P5) -5 .. 5 V
- 0..10
- 0..5
- 0..12
- Číslo výkresu /drawing number/:
- Nazev listu/sheet name/:
- DPS projekt/PCB project/:
- Kreslil /drawn by/ :
- Kontroloval /checked by/:
- Schvalil /approved by/:
- Podpis /signature/:
- Datum /date/:
- List /sheet/:
- /
- (in symbol NYS232) PCB_RING
- (in symbol Trimmer universal 3/8 (10mm)) CW

### Library data of the parts
C14-C22 = 885012206095: WCAP-CSGP Multilayer Ceramic Chip Capacitor, General Purpose, size 0603, X7R, 100nF, 50V; Manufacturer: Wurth Elektronik; Capacitance Tolerance: +/-10%; Dissipation Factor: 3%; Isolation Resistance: 5GOhm; Technical Reference: X7R0603104K050DFCT10000; Capacitance: 100nF; Ceramic Type: X7R; ComponentLink1Description: Manufacturer Link; ComponentLink1URL: http://www.we-online.de; ComponentLink2Description: Datasheet; ComponentLink2URL: https://www.we-online.com/catalog/datasheet/885012206095.pdf; Height: 0.8mm; Length: 1.6mm; Manufacturer Part Number: 885012206095; Mounting Technology: SMT; Operating Temperature max.: 125C; Operating Temperature min.: -55C; Packaging: Tape and Reel; Rated Voltage: 50V; Size: 0603; Width: 0.8mm
CK1 CK3-CK7 = ECK+10U50VXX0: C; 10u; 50V; 10%; X7R; ??;; Manufacturer: Murata: GRM32ER71H106KA12L;;Samsung Electro-mechanics: CL32B106KBJNNNE; Note: X7R, 9uF @ 10V, 5uF @ 30V, 2.5uF @ 50V; Component_Class: Capacitor; Status_I: Production; Status_II: Active; Tolerance_Pct: 10; Voltage_Rating_V: 50; Capacitance_F: 1E-5; KK: ECK+10U50VXX0; Value: 10u; SMD: 1; ComponentLink2URL: I:\DataSheets\ECK+10U50VXX0_MurataEN100.pdf; ComponentLink2Description: ECK+10U50VXX0_MurataEN100.pdf; ComponentLink3URL: I:\DataSheets\ECK+10U50VXX0_SamsungEN100.pdf; ComponentLink3Description: ECK+10U50VXX0_SamsungEN100.pdf; Dielectric_Type: X7R; ComponentLink1URL: heliosgreen://v1/hegMT/5-MT/Classes(343)/Folders/OpenForm?RecordNumbers=[10658879]; ComponentLink1Description: Helios
CK2 = ECK+100N50V0603XXK: C; 100n; 50V; 10%; X7R; ??;; KK: ECK+100N50V0603XXK
DL1-DL4 = EDL+SMDGREENXX1: Ind; Light; Green;; Manufacturer: KINGBRIGHT: KP-2012MGC; Note: 568nm dominant; Component_Class: Indicator; Status_I: Production; Status_II: Active; KK: EDL+SMDGREENXX1; Value: SMDGREEN; SMD: 1; ComponentLink2URL: i:\datasheets\EDL+SMDGREENXX1_KingBright.pdf; ComponentLink2Description: EDL+SMDGREENXX1_KingBright.pdf; Indicator_Type: Light; Indicator_Output: Green; ComponentLink1URL: heliosgreen://v1/hegMT/5-MT/Classes(343)/Folders/OpenForm?RecordNumbers=[380589]; ComponentLink1Description: Helios
J1 = EJ-W4230-06PDSTB0RXX0: Con; Micro Fit 3.0; 6x; PCB; Straight; 250V; 5A; Male; Tin; ??;; Manufacturer: HSUAN MAO: W4230-06PDSTB0R;;HSUAN MAO: W4230-06PDSTB0N;;HSM: W4230-06PDSTB0R;;HSM: W4230-06PDSTB0N; Component_Class: Connector; Status_I: Production; Status_II: Active; Multiplicity: 6; Voltage_Rating_V: 250; Current_Rating_A: 5; KK: EJ-W4230-06PDSTB0RXX0; Value: W4230-06PDSTB0R; SMD: 0; ComponentLink2URL: i:\datasheets\EJ-W4230-XXPDSXB0RXX0_HsuanMao.pdf; ComponentLink2Description: EJ-W4230-XXPDSXB0RXX0_HsuanMao.pdf; ComponentLink3URL: I:\datasheets\EJ-W4230-XXPDSTB0NXX0_HsuanMaoEN100.pdf; ComponentLink3Description: EJ-W4230-XXPDSTB0NXX0_HsuanMaoEN100.pdf; Mounting_Style: PCB; Connector_Family: Micro Fit 3.0; Angle: Straight; Gender: Male; Plating: Tin; ComponentLink1URL: heliosgreen://v1/hegMT/5-MT/Classes(343)/Folders/OpenForm?RecordNumbers=[6765380]; ComponentLink1Description: Helios; System: Connector
J4 J5 = EJ-W4230-08PDSGB0RXX0: Con; Micro Fit 3.0; 8x; PCB; Straight; 250V; 5A; Male; Gold; ??;; KK: EJ-W4230-08PDSGB0RXX0
P1-P10 = NYS232: 6.3 mm jack, right angle, THT
R6 R57-R68 = R 0603 universal: Thick Film resistor, 0603 Size, universal value, 0.1 W; Tolerance & Rating: 1%/0.1W; Signal Integrity: Res; consumption: 0; RPP: 0,0188; Package: 0603; Simulation: Res; SMD: 1; ComponentLink1Description: ER+xxxx0.1W0603XXx_YageoEN100.pdf; ComponentLink1URL: i:\DataSheets\ER+xxxx0.1W0603XXx_YageoEN100.pdf; ComponentLink3Description: rezistor čip; ComponentLink3URL: heliosgreen://v1/hegMT/5-MT/Classes(343)/Folders/OpenForm?RecordNumbers=[6094847]
  R6 R65-R68: Value: 10k
  R57: Value: 1k8
  R58: Value: 4k7
  R59 R60: Value: 100k
  R61-R64: Value: 100R
U1 U4 = EU+OPA4197IDRXX0: IC; Opamp; 4.5V; 36V; 4x;; KK: EU+OPA4197IDRXX0
VR3-VR5 = Trimmer universal 3/8 (10mm): 093 - 3/8" Square (10 mm) Multi-Turn Cermet Trimmer; KK: ERP-10K0.5WXX0; Value: 10k; SMD: 0; ComponentLink1Description: Datasheet
D1-D12 = BAV99: ComponentLink1Description: New link; ComponentLink1URL: C:\Users\Public\Documents\Altium\DSH\EDD+BAV99XX0_OnsemiEN100.PDF

## Sheet VCO_core.SchDoc
size A3; Organization: Medical Technologies CZ a.s.; Version1: N/A; Version2: N/A; Version3: N/A; Change1description: N/A; Change2description: N/A; Change3description: N/A; Change1DrawnBy: N/A; Change2DrawnBy: N/A; Change3DrawnBy: N/A; Change1CheckedBy: N/A; Change2CheckedBy: N/A; Change3CheckedBy: N/A; PreviusVersion_Chng1: N/A; PreviusVersion_Chng2: N/A; PreviusVersion_Chng3: N/A; Variant1description: Standard assembly; Variant2description: N/A; Variant3description: N/A; Variant4description: N/A; PrimaryCard1: XXXxxxXXX; PrimaryCard2: N/A; PrimaryCard3: N/A; PrimaryCard4: N/A; DocumentName: Docname
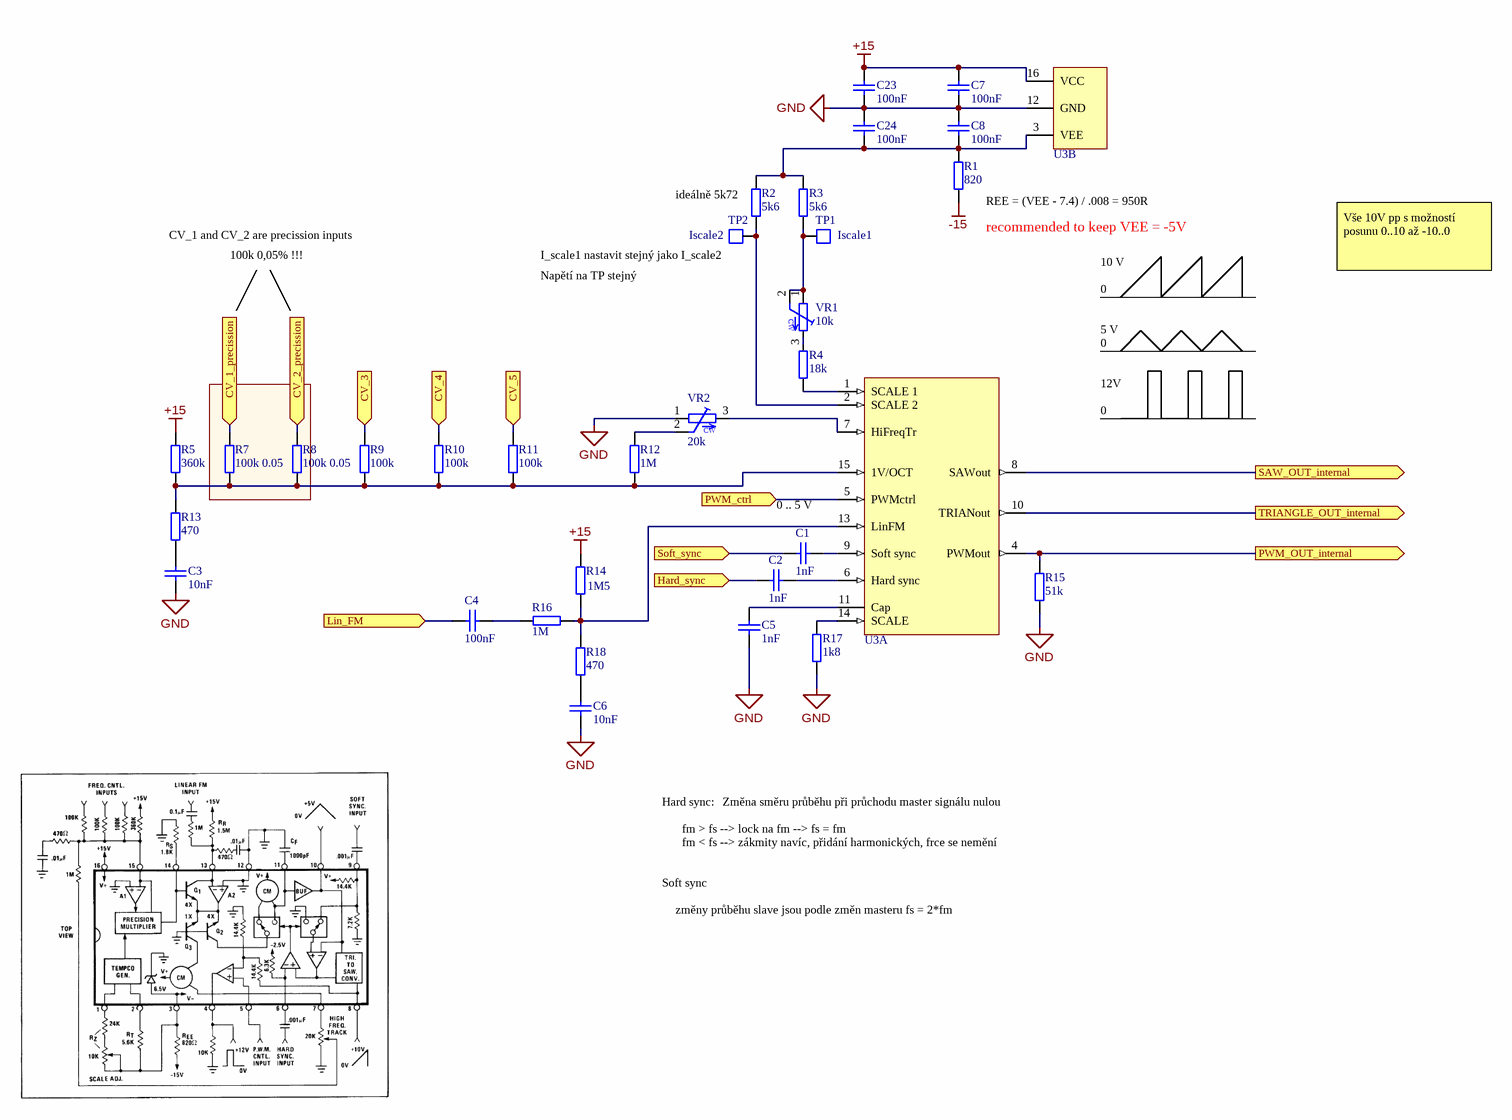
[diagram p2: VCO_core.SchDoc]

### Parts
C1  1nF  [WCAP-CSGP_0603_L1.6W0.8H0.8_Reflow]
C2  1nF  [WCAP-CSGP_0603_L1.6W0.8H0.8_Reflow]
C3  10nF  [WCAP-CSGP_0603_L1.6W0.8H0.8_Reflow]
C4  100nF  [WCAP-CSGP_0603_L1.6W0.8H0.8_Reflow]
C5  1nF  [WCAP-CSGP_0603_L1.6W0.8H0.8_Reflow]
C6  10nF  [WCAP-CSGP_0603_L1.6W0.8H0.8_Reflow]
C7  100nF  [WCAP-CSGP_0603_L1.6W0.8H0.8_Reflow]
C8  100nF  [WCAP-CSGP_0603_L1.6W0.8H0.8_Reflow]
C23  100nF  [WCAP-CSGP_0603_L1.6W0.8H0.8_Reflow]
C24  100nF  [WCAP-CSGP_0603_L1.6W0.8H0.8_Reflow]
R1  820  [RESC1608X06N(SMR0603)]
R2  5k6  [RESC1608X06N(SMR0603)]
R3  5k6  [RESC1608X06N(SMR0603)]
R4  18k  [RESC1608X06N(SMR0603)]
R5  360k  [RESC1608X06N(SMR0603)]
R7  100k 0.05  [RESC1608X06N(SMR0603)]
R8  100k 0.05  [RESC1608X06N(SMR0603)]
R9  100k  [RESC1608X06N(SMR0603)]
R10  100k  [RESC1608X06N(SMR0603)]
R11  100k  [RESC1608X06N(SMR0603)]
R12  1M  [RESC1608X06N(SMR0603)]
R13  470  [RESC1608X06N(SMR0603)]
R14  1M5  [RESC1608X06N(SMR0603)]
R15  51k  [RESC1608X06N(SMR0603)]
R16  1M  [RESC1608X06N(SMR0603)]
R17  1k8  [RESC1608X06N(SMR0603)]
R18  470  [RESC1608X06N(SMR0603)]
TP1  Iscale1  [TP_1.5_SMD_ROUND]  (no BOM)
TP2  Iscale2  [TP_1.5_SMD_ROUND]  (no BOM)
U3  CEM3340  [DIP-16]  (value not drawn)  (parts A,B of 2)
VR1  10k  [64W]
VR2  20k  [64W]

### Ports
CV_1_precission (in), CV_2_precission (in), CV_3 (in), CV_4 (in), CV_5 (in), Hard_sync (in), Lin_FM (in), PWM_ctrl (in), PWM_OUT_internal (out), SAW_OUT_internal (out), Soft_sync (in), TRIANGLE_OUT_internal (out)

### Nets
+15: C7.2 C23.2 R5.1 R14.2 U3.16(VCC)
-15: R1.1
GND: C3.2 C5.1 C6.1 C7.1 C8.2 C23.1 C24.2 R15.1 R17.1 U3.12(GND) VR2.1
CV_1_precission: R7.1 ; port CV_1_precission
CV_2_precission: R8.1 ; port CV_2_precission
CV_3: R9.1 ; port CV_3
CV_4: R10.1 ; port CV_4
CV_5: R11.1 ; port CV_5
Hard_sync: C2.1 ; port Hard_sync
Lin_FM: C4.1 ; port Lin_FM
PWM_ctrl: U3.5(PWMctrl) ; port PWM_ctrl
Soft_sync: C1.1 ; port Soft_sync
NetC1_2: C1.2 U3.9(Soft_sync)
NetC2_2: C2.2 U3.6(Hard_sync)
NetC3_1: C3.1 R13.2
NetC4_2: C4.2 R16.2
NetC5_2: C5.2 U3.11(Cap)
NetC6_2: C6.2 R18.1
NetC8_1: C8.1 C24.1 R1.2 R2.2 R3.2 U3.3(VEE)
NetR2_1: R2.1 TP2.1 U3.2(SCALE_2)
NetR3_1: R3.1 TP1.1 VR1.1 VR1.2
NetR4_1: R4.1 VR1.3
NetR4_2: R4.2 U3.1(SCALE_1)
NetR5_2: R5.2 R7.2 R8.2 R9.2 R10.2 R11.2 R12.1 R13.1 U3.15(1V/OCT)
NetR12_2: R12.2 VR2.2
NetR14_1: R14.1 R16.1 R18.2 U3.13(LinFM)
NetR15_2: R15.2 U3.4(PWMout) ; port PWM_OUT_internal
NetR17_2: R17.2 U3.14(SCALE)
NetR42_2: U3.8(SAWout) ; port SAW_OUT_internal
NetU3_7: U3.7(HiFreqTr) VR2.3
NetU3_10: U3.10(TRIANout) ; port TRIANGLE_OUT_internal

### Notes on the sheet
- (near R2) ideálně 5k72
- (near R1) REE = (VEE - 7.4) / .008 = 950R
- CV_1 and CV_2 are precission inputs
- 100k 0,05% !!!
- (near TP2) I_scale1 nastavit stejný jako I_scale2
- Napětí na TP stejný
- (near R1) recommended to keep VEE = -5V
- 10 V
- Vše 10V pp s možností posunu 0..10 až -10..0
- 0
- 5 V
- 12V
- 0 .. 5 V
- Hard sync:
- Změna směru průběhu při průchodu master signálu nulou
- Soft sync
- fm > fs --> lock na fm --> fs = fm
- fm < fs --> zákmity navíc, přidání harmonických, frce se nemění
- změny průběhu slave jsou podle změn masteru fs = 2*fm
- Číslo výkresu /drawing number/:
- Nazev listu/sheet name/:
- DPS projekt/PCB project/:
- Kreslil /drawn by/ :
- Kontroloval /checked by/:
- Schvalil /approved by/:
- Podpis /signature/:
- Datum /date/:
- List /sheet/:
- /
- (in symbol Trimmer universal 3/8 (10mm)) CW

### Library data of the parts
C1 C2 C5 = 885012006063: WCAP-CSGP Multilayer Ceramic Chip Capacitor, General Purpose, size 0603, NP0, 1nF, 50V; Manufacturer: Wurth Elektronik; Capacitance Tolerance: +/-5%; Isolation Resistance: 10GOhm; Q-Factor: 1000; Technical Reference: NP00603102J050DFCT10000; Capacitance: 1nF; Ceramic Type: NP0; ComponentLink1Description: Manufacturer Link; ComponentLink1URL: http://www.we-online.de; ComponentLink2Description: Datasheet; ComponentLink2URL: https://www.we-online.com/catalog/datasheet/885012006063.pdf; Height: 0.8mm; Length: 1.6mm; Manufacturer Part Number: 885012006063; Mounting Technology: SMT; Operating Temperature max.: 125C; Operating Temperature min.: -55C; Packaging: Tape and Reel; Rated Voltage: 50V; Size: 0603; Width: 0.8mm
C3 C6 = 885012206089: WCAP-CSGP Multilayer Ceramic Chip Capacitor, General Purpose, size 0603, X7R, 10nF, 50V; Manufacturer: Wurth Elektronik; Capacitance Tolerance: +/-10%; Dissipation Factor: 2.5%; Isolation Resistance: 10GOhm; Technical Reference: X7R0603103K050DFCT10000; Capacitance: 10nF; Ceramic Type: X7R; ComponentLink1Description: Manufacturer Link; ComponentLink1URL: http://www.we-online.de; ComponentLink2Description: Datasheet; ComponentLink2URL: https://www.we-online.com/catalog/datasheet/885012206089.pdf; Height: 0.8mm; Length: 1.6mm; Manufacturer Part Number: 885012206089; Mounting Technology: SMT; Operating Temperature max.: 125C; Operating Temperature min.: -55C; Packaging: Tape and Reel; Rated Voltage: 50V; Size: 0603; Width: 0.8mm
C4 C7 C8 C23 C24 = 885012206095: as C14 on sheet main; Capacitance: 100nF; Ceramic Type: X7R; ComponentLink1Description: Manufacturer Link; ComponentLink1URL: http://www.we-online.de; ComponentLink2Description: Datasheet; ComponentLink2URL: https://www.we-online.com/catalog/datasheet/885012206095.pdf; Height: 0.8mm; Length: 1.6mm; Manufacturer Part Number: 885012206095; Mounting Technology: SMT; Operating Temperature max.: 125C; Operating Temperature min.: -55C; Packaging: Tape and Reel; Rated Voltage: 50V; Size: 0603; Width: 0.8mm
R1-R5 R9-R18 = R 0603 universal: as R6 on sheet main; Package: 0603; Simulation: Res; SMD: 1; ComponentLink1Description: ER+xxxx0.1W0603XXx_YageoEN100.pdf; ComponentLink1URL: i:\DataSheets\ER+xxxx0.1W0603XXx_YageoEN100.pdf; ComponentLink3Description: rezistor čip; ComponentLink3URL: heliosgreen://v1/hegMT/5-MT/Classes(343)/Folders/OpenForm?RecordNumbers=[6094847]
  R1: Value: 820
  R2 R3: Value: 5k6
  R4: Value: 18k
  R5: Value: 360k
  R9-R11: Value: 100k
  R12 R16: Value: 1M
  R13 R18: Value: 470
  R14: Value: 1M5
  R15: Value: 51k
  R17: Value: 1k8
R7 R8 = R 0603 universal: Precision Thick Film resistor, 0603 Size, universal value, 0.1 W; Tolerance & Rating: 0,05%/0.1W; Signal Integrity: Res; consumption: 0; RPP: 0,0188; Value: 100k 0.05; Package: 0603; Simulation: Res; SMD: 1; ComponentLink1Description: ER+xxxx0.1W0603XXx_YageoEN100.pdf; ComponentLink1URL: i:\DataSheets\ER+xxxx0.1W0603XXx_YageoEN100.pdf; ComponentLink3Description: rezistor čip; ComponentLink3URL: heliosgreen://v1/hegMT/5-MT/Classes(343)/Folders/OpenForm?RecordNumbers=[6094847]
TP1 TP2 = 000-TPSMT100: De; Test Point;; KK: 000-TPSMT100
U3 = CEM3340: ALFA RPAR AS3340 VCO (CEM3340)
VR1 VR2 = Trimmer universal 3/8 (10mm): as VR3 on sheet main; SMD: 0; ComponentLink1Description: Datasheet
  VR1: Value: 10k
  VR2: Value: 20k